# EAGLE board ESP32 Display 7.0 inch V1.2 (EAGLE 9.6.2), part 1 of 2
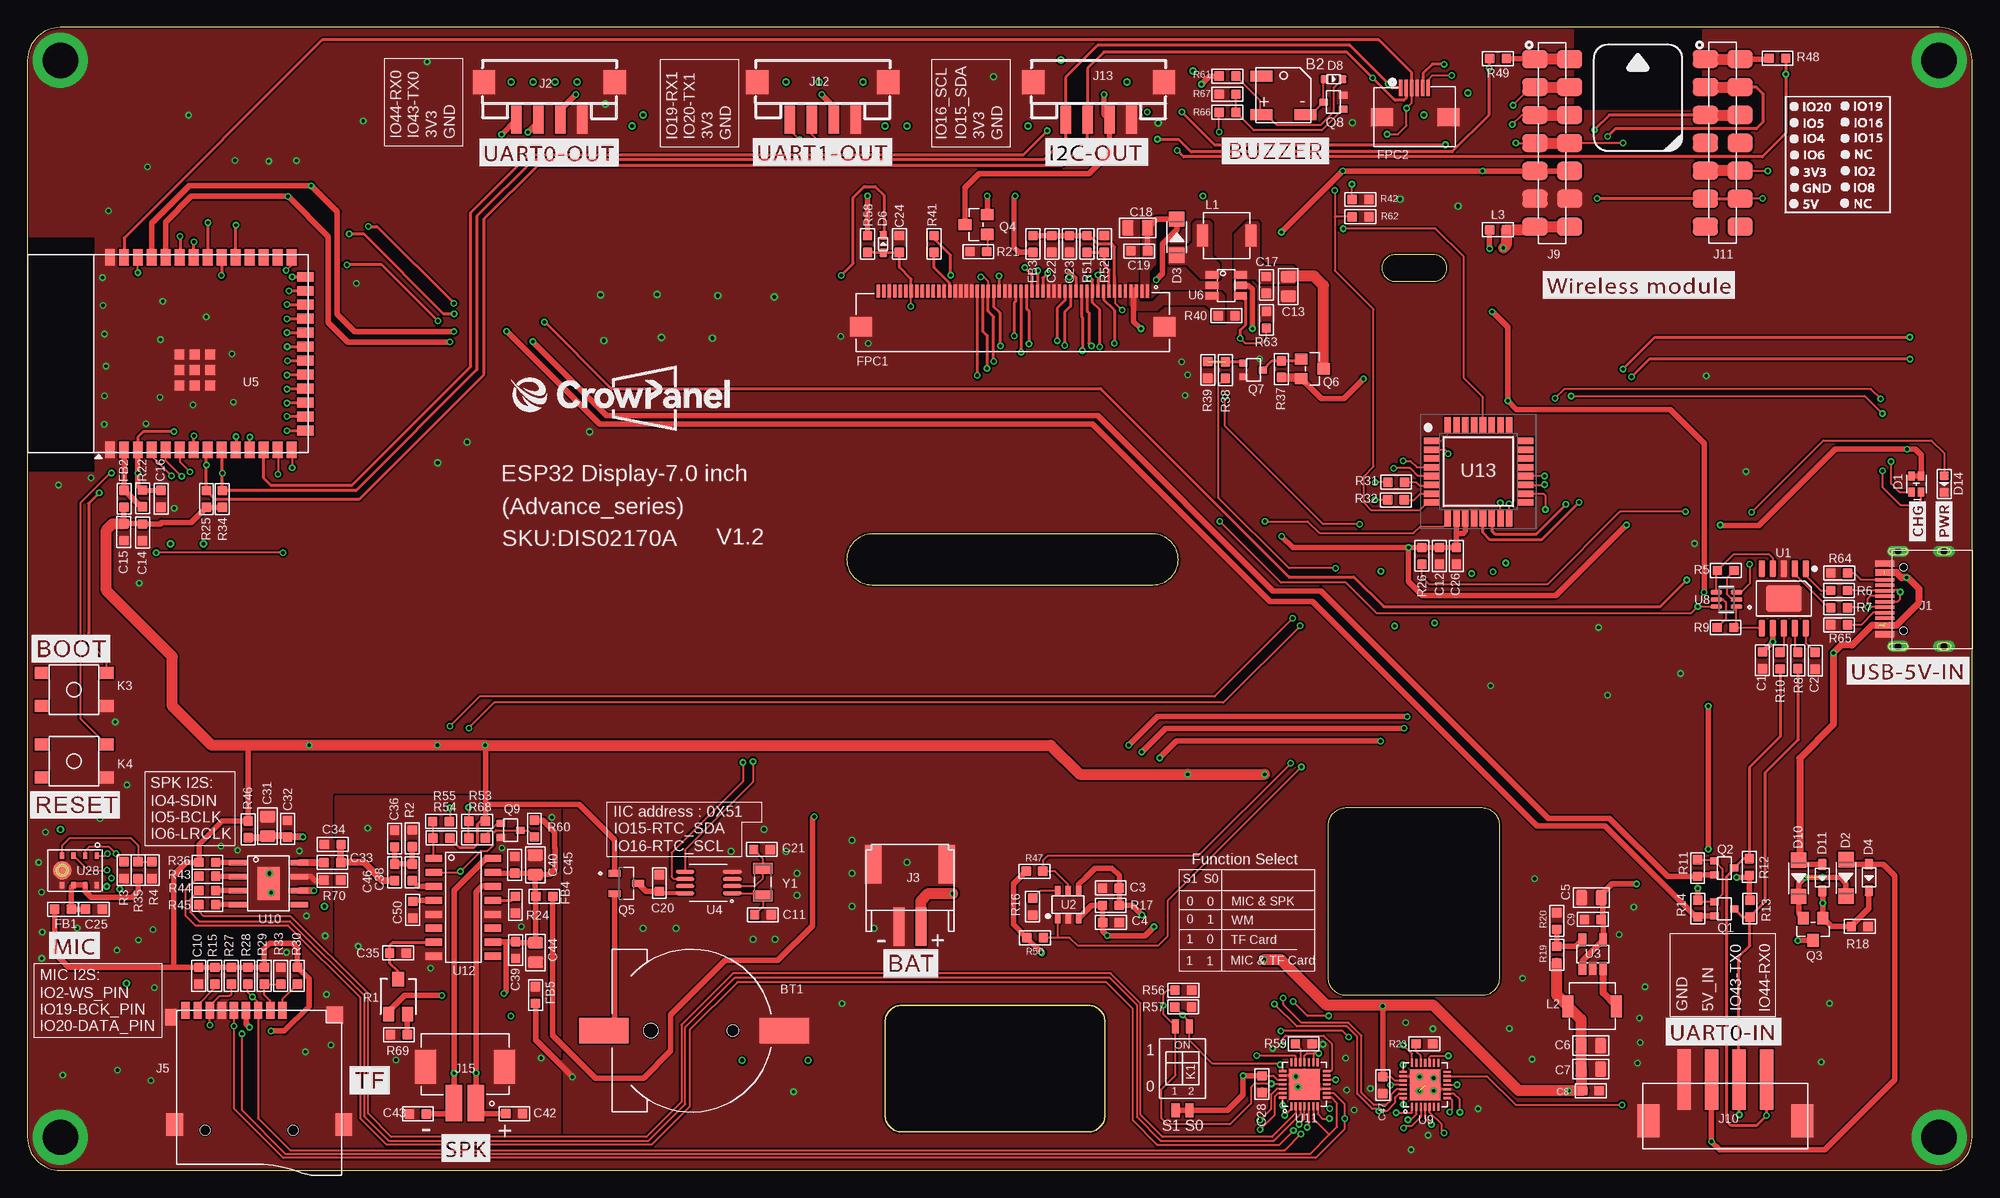
[diagram p5: board, top side]
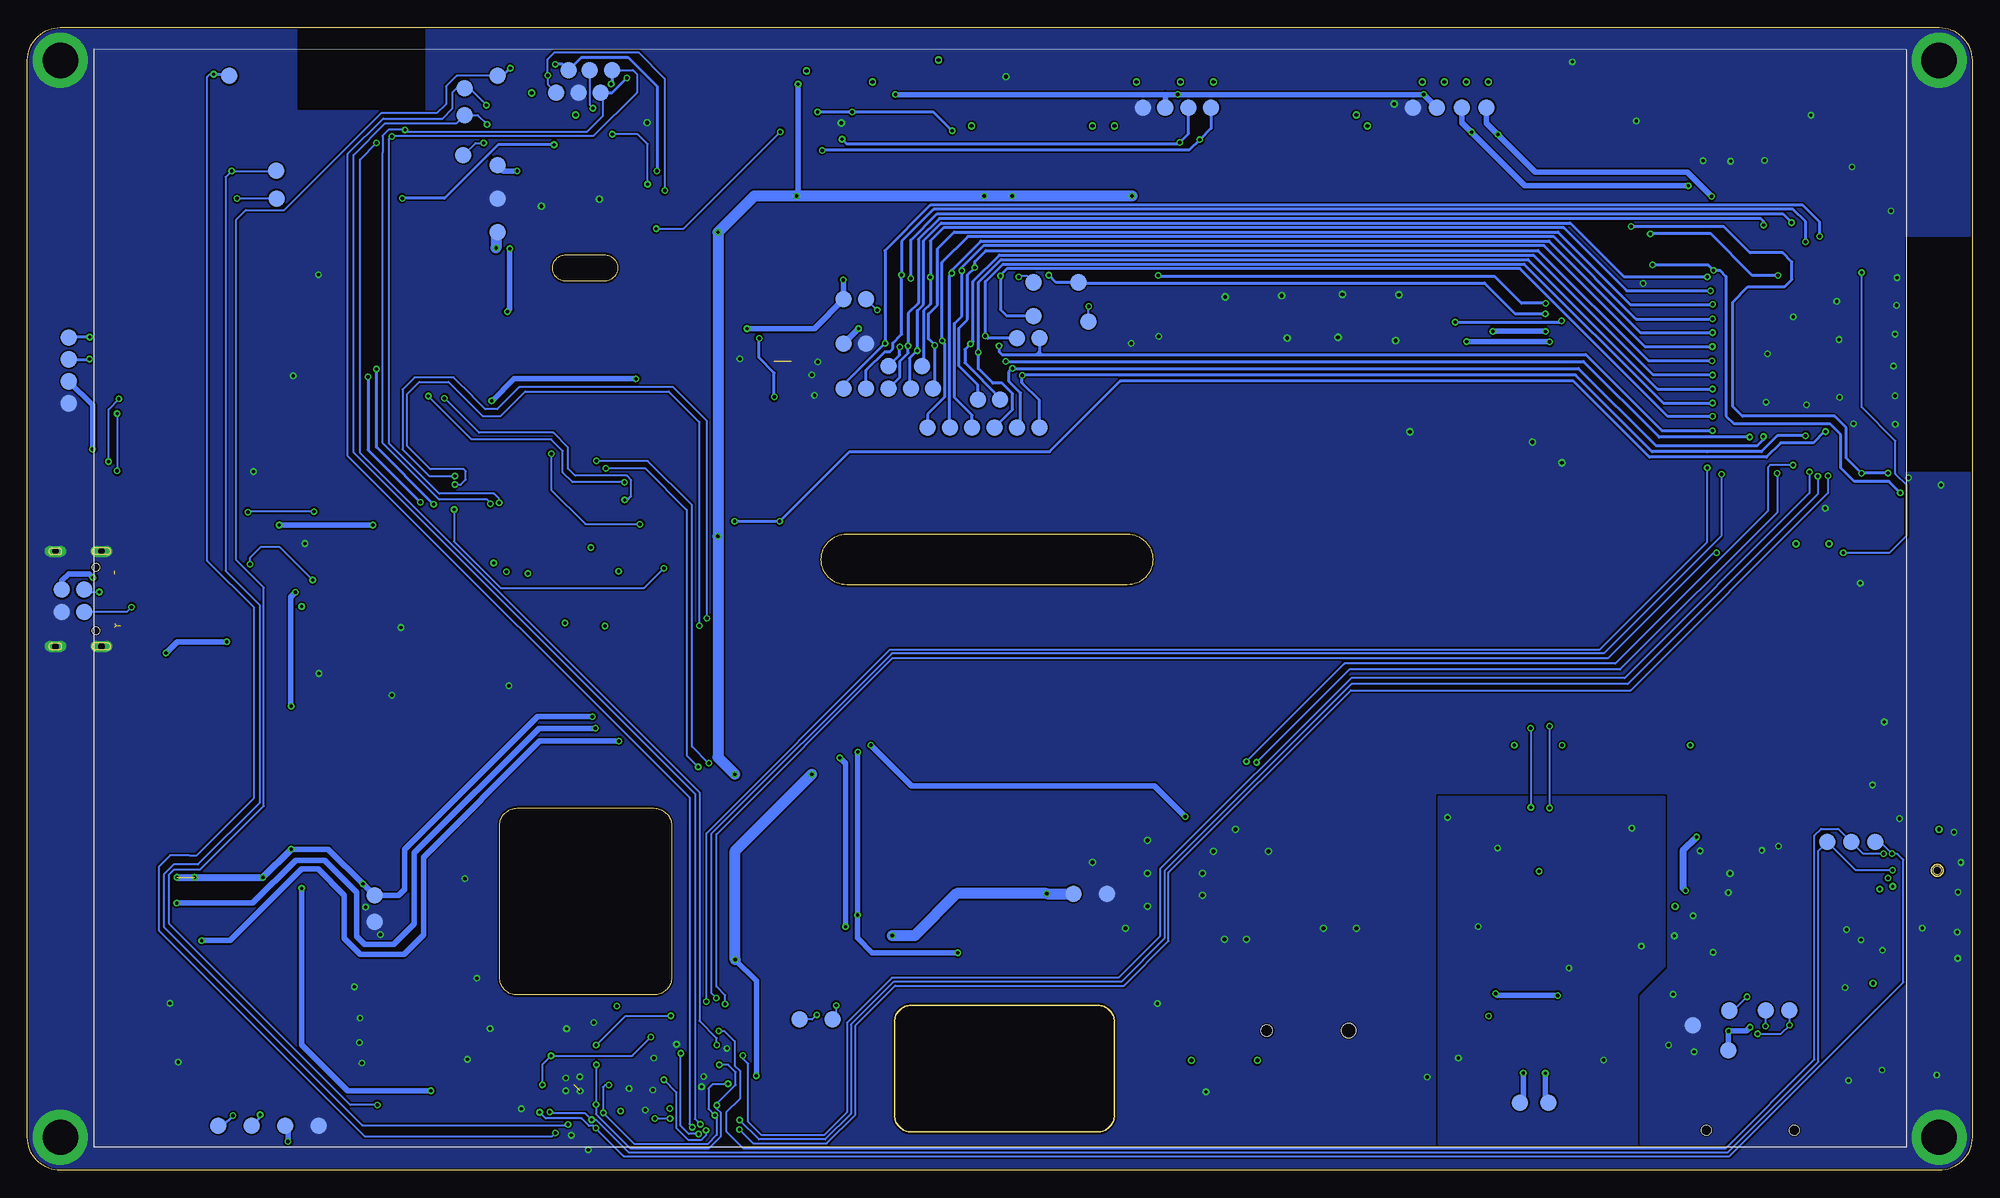
[diagram p6: board, bottom side, seen from below]

Size 176.86 x 103.96 mm. Coordinates in mm from the lower left corner, seen from the top.
Outline: 0,100.96 0,3 arc90 3,0 173.86,0 arc90 176.86,3 176.86,100.96 arc90 173.86,103.96 3,103.96 arc90 0,100.96
Outline: 132.32,32.95 119.88,32.95 arc90 118.28,31.34 118.28,17.55 arc90 119.88,15.95 132.32,15.95 arc90 133.92,17.55 133.92,31.34 arc90 132.32,32.95
Outline: 124.39,80.88 127.91,80.88 arc180 127.91,83.28 124.39,83.28 arc180 124.39,80.88
Outline: 76.82,53.26 102.36,53.26 arc180 102.36,57.88 76.82,57.88 arc180 76.82,53.26
Outline: 98,13.5 98,5 arc-90 96.5,3.5 79.5,3.5 arc-90 78,5 78,13.5 arc-90 79.5,15 96.5,15 arc-90 98,13.5
Outline: circle at 3.14,27.27 radius 0.51
Copper layers (1*16): Top 0.035mm / dielectric 1.5mm / Bottom 0.035mm
Design rules "HMI_GZ *": minimum track width 8mil, minimum drill 0.3mm, track to track 6mil, track to pad 6mil, pad to pad 4mil, via to via 6mil, smd to smd 6mil, copper to edge 6mil, drill to drill 4mil, minimum pad ring 6mil, minimum via ring 6mil, stop-mask expansion 4mil, vias tented up to drill 100mil, thermal gap 0mil
tKeepout: area 0,64 to 6,84.7; area 140,99.8 to 152.9,104
tRestrict: area 140.7,96.5 to 152.3,104; area 0,63.6 to 6.1,84.9
bRestrict: area 140.7,96.5 to 152.3,104; area 0,63.6 to 6.1,84.9

## Footprints (pad centres in the part's own frame; a part is rotated, then mirrored left to right if it is on the bottom)
BEEP_5025 = smd 2 x 1: 1 -2,-1.75; 2 2,-1.75; 3 -2,1.75
CR1220 = smd 2.3 x 4.5: N 0,8.425; P 0,-7.975 | hole 1.3: 0,-3.725 | hole 1.05: 0,3.725
C0603 = smd 0.889 x 0.889: 1 -0.762,0; 2 0.762,0
C0805 = smd 1.016 x 1.397: 1 -0.889,0; 2 0.889,0
LED_KT-0603RYG = smd 0.85 x 0.6: 1 0.725,-0.425; 2 0.725,0.425; 3 -0.725,-0.425; 4 -0.725,0.425
D_SOD123FL = smd 1.397 x 1.397: + -1.651,0; - 1.651,0
D_SOD323 = smd 1 x 0.8: + -1.2,0; - 1.2,0
D_SOD523 = smd 0.762 x 0.7: + -0.8,0; - 0.8,0
LED0603 = smd 0.762 x 0.889: + -0.762,0; - 0.762,0
L0603 = smd 0.889 x 0.889: 1 -0.762,0; 2 0.762,0
FPC-P0.5MM-50P-SMD = smd 2 x 1.8: 51 -13.8,-1.625; 52 13.8,-1.625 | smd 0.3 x 1.2: P$1 12.25,1.625; P$2 11.75,1.625; P$3 11.25,1.625; P$4 10.75,1.625; P$5 10.25,1.625; P$6 9.75,1.625; P$7 9.25,1.625; P$8 8.75,1.625; P$9 8.25,1.625; P$10 7.75,1.625; P$11 7.25,1.625; P$12 6.75,1.625; P$13 6.25,1.625; P$14 5.75,1.625; P$15 5.25,1.625; P$16 4.75,1.625; P$17 4.25,1.625; P$18 3.75,1.625; P$19 3.25,1.625; P$20 2.75,1.625; P$21 2.25,1.625; P$22 1.75,1.625; P$23 1.25,1.625; P$24 0.75,1.625; P$25 0.25,1.625; P$26 -0.25,1.625; P$27 -0.75,1.625; P$28 -1.25,1.625; P$29 -1.75,1.625; P$30 -2.25,1.625; P$31 -2.75,1.625; P$32 -3.25,1.625; P$33 -3.75,1.625; P$34 -4.25,1.625; P$35 -4.75,1.625; P$36 -5.25,1.625; P$37 -5.75,1.625; P$38 -6.25,1.625; P$39 -6.75,1.625; P$40 -7.25,1.625; P$41 -7.75,1.625; P$42 -8.25,1.625; P$43 -8.75,1.625; P$44 -9.25,1.625; P$45 -9.75,1.625; P$46 -10.25,1.625; P$47 -10.75,1.625; P$48 -11.25,1.625; P$49 -11.75,1.625; P$50 -12.25,1.625
FPC-6PIN-0.5MM = smd 0.3 x 1.5: 1 -1.31,2.184; 2 -0.81,2.184; 3 -0.31,2.184; 4 0.19,2.184; 5 0.69,2.184; 6 1.19,2.184 | smd 2 x 1.6: 7 -3.01,-0.496; 8 3.036,-0.496
USB-3.0TYPEC-SMD = smd 0.3 x 1.7: A1 -3.35,0.5; A4 -2.55,0.5; A5 -1.25,0.5; A6 -0.25,0.5; A7 0.25,0.5; A8 1.25,0.5; A9 2.55,0.5; A12 3.35,0.5; B1 3.05,0.5; B4 2.25,0.5; B5 1.75,0.5; B6 0.75,0.5; B7 -0.75,0.5; B8 -1.75,0.5; B9 -2.25,0.5; B12 -3.05,0.5 | drill 0.6 pad 1.016 long: P$1 -4.325,-0.72; P$2 4.325,-0.72; P$3 -4.325,-4.9; P$4 4.325,-4.9 | hole 0.68: -2.89,-1.22; 2.89,-1.22
CONNECTOR_4P-SMD-2.0 = smd 0.965 x 2.54: 1 -3,0; 2 -1,0; 3 1,0; 4 3,0 | smd 2.032 x 2.184: SS1 -5.946,3.4; SS2 5.946,3.4
PH2.0WT-2PIN = smd 1 x 3.5: P$1 -1,0; P$2 1,0 | smd 1.5 x 3.5: P$3 -3.35,-5.7; P$4 3.35,-5.7
THO-M3.2*5MM-HOLE = drill 3.2 pad 5: P$1 0,0
9P-SMD-W/-RING = smd 1.524 x 0.762: 1 0,4.4; 2 0,3.3; 3 0,2.2; 4 0,1.1; 5 0,0; 6 0,-1.1; 7 0,-2.2; 8 0,-3.3; 9 0,-4.4 | smd 1.524 x 1.016: G1 0.6,-5.746 | smd 2.032 x 1.524: G2 10.373,-5.4; G3 10.373,10 | smd 1.524 x 1.524: G4 0.392,9.181 | hole 0.889: 10.9,-2.6; 10.9,5.4
H7-2.54-18.28X2.5X5MM = smd 1.65 x 2.3: 1 -7.62,-1.58; 1-1 -7.62,1.58; 2 -5.08,-1.58; 2-2 -5.08,1.58; 3 -2.54,-1.58; 3-3 -2.54,1.58; 4 0,-1.58; 4-4 0,1.58; 5 2.54,-1.58; 5-5 2.54,1.58; 6 5.08,-1.58; 6-6 5.08,1.58; 7 7.62,-1.58; 7-7 7.62,1.58
XH2.54-4P-SMD = smd 1.2 x 5.5: 1 -3.75,-1.875; 2 -1.25,-1.875; 3 1.25,-1.875; 4 3.75,-1.875 | smd 2 x 3: 5 -7,1.875; 6 7,1.875
TEST-PIN-4-2.0MM = smd 1.5 x 1.5: 1 -3,0; 2 -1,0; 3 1,0; 4 3,0
CONN-TH_2P-P2.00_XUNPU_WAFER-PH2.0-2PLB = smd 1.5 x 3.3: 1 -1,1.65; 2 1,1.65 | smd 1.9 x 3.1: 3 3.6,-1.65; 4 -3.6,-1.65
SW-SMD_DSHP02TS-S_1 = smd 0.76 x 1.27: 1 -0.635,-3.81; 2 0.635,-3.81 | smd 0.635 x 1.27: 3 0.635,3.81; 4 -0.635,3.81
KEY-4.5X4.5-SMD = smd 1.35 x 1.1: 1 -2.925,1.5; 2 -2.925,-1.5; 3 2.925,-1.5; 4 2.925,1.5
L0420 = smd 2 x 1: 1 0,2.2; 2 0,-2.2
TEST_PAD-1.5MM = smd 1.5 x 1.5: P$1 0,0
MOS_SOT323 = smd 0.635 x 0.762: 1 -0.635,-0.889; 2 0.635,-0.889; 3 0,0.889
PMOS_SOT23 = smd 1.016 x 1.143: 1 -0.889,-1.016; 2 0.889,-1.016; 3 0,1.016
SOT-23 = smd 1.09 x 0.61: 1 -1.07,0.915; 2 -1.07,-0.915; 3 1.07,0
3P-SMD-SQUA-3.6X3.3 = smd 1 x 1.3: 1 -0.85,-1.6; 3 0.85,-1.6 | smd 1.1 x 1.3: 2 0,1.6
R0603-SP = smd 0.889 x 0.889: 1 -0.762,0; 2 0.762,0
ESOP-10-EP-150MIL = smd 1.5 x 0.6: 1 -2.7,2; 2 -2.7,1; 3 -2.7,0; 4 -2.7,-1; 5 -2.7,-2; 6 2.7,-2; 7 2.7,-1; 8 2.7,0; 9 2.7,1; 10 2.7,2 | smd 2.4 x 3.2: EP 0,0
SOT23-6L = smd 0.5 x 0.9: 1 -0.961,-1.212; 2 -0.011,-1.212; 3 0.94,-1.212; 4 0.94,1.288; 5 -0.011,1.288; 6 -0.961,1.288
IC_SOT23-5 = smd 0.69 x 1.2: 1 -0.95,-1.3; 2 0,-1.3; 3 0.95,-1.3; 4 0.95,1.3; 5 -0.95,1.3
MSOP-8 = smd 0.364 x 1.692: 1 -0.975,-2.146; 2 -0.325,-2.146; 3 0.325,-2.146; 4 0.975,-2.146; 5 0.975,2.146; 6 0.325,2.146; 7 -0.325,2.146; 8 -0.975,2.146
ESP32-S3-WROOM-1-SMD41 = smd 1.5 x 0.9: 1 -8.75,5.26; 2 -8.75,3.99; 3 -8.75,2.72; 4 -8.75,1.45; 5 -8.75,0.18; 6 -8.75,-1.09; 7 -8.75,-2.36; 8 -8.75,-3.63; 9 -8.75,-4.9; 10 -8.75,-6.17; 11 -8.75,-7.44; 12 -8.75,-8.71; 13 -8.75,-9.98; 14 -8.75,-11.25; 27 8.75,-11.25; 28 8.75,-9.98; 29 8.75,-8.71; 30 8.75,-7.44; 31 8.75,-6.17; 32 8.75,-4.9; 33 8.75,-3.63; 34 8.75,-2.36; 35 8.75,-1.09; 36 8.75,0.18; 37 8.75,1.45; 38 8.75,2.72; 39 8.75,3.99; 40 8.75,5.26 | smd 0.9 x 1.5: 15 -6.985,-12.5; 16 -5.715,-12.5; 17 -4.445,-12.5; 18 -3.175,-12.5; 19 -1.905,-12.5; 20 -0.635,-12.5; 21 0.635,-12.5; 22 1.905,-12.5; 23 3.175,-12.5; 24 4.445,-12.5; 25 5.715,-12.5; 26 6.985,-12.5 | smd 0.9 x 0.9: 41 -2.9,-1.06; 42 -1.5,-1.06; 43 -0.1,-1.06; 44 -2.9,-2.46; 45 -1.5,-2.46; 46 -0.1,-2.46; 47 -2.9,-3.86; 48 -1.5,-3.86; 49 -0.1,-3.86
COOPER_SOT23-6 = smd 0.69 x 1.2: 1 -0.95,-1.3; 2 0,-1.3; 3 0.95,-1.3; 4 0.95,1.3; 5 0,1.3; 6 -0.95,1.3
SOP65P210X100-6N = smd 1.09 x 0.4: 1 -0.92,0.65; 2 -0.92,0; 3 -0.92,-0.65; 4 0.92,-0.65; 5 0.92,0; 6 0.92,0.65
QFN-28_L4.0-W4.0-P0.40-BL-EP2.8 = smd 0.2 x 0.7: 1 -1.2,-2; 2 -0.8,-2; 3 -0.4,-2; 4 0,-2; 5 0.4,-2; 6 0.8,-2; 7 1.2,-2; 15 1.2,2; 16 0.8,2; 17 0.4,2; 18 0,2; 19 -0.4,2; 20 -0.8,2; 21 -1.2,2 | smd 0.7 x 0.2: 8 2,-1.2; 9 2,-0.8; 10 2,-0.4; 11 2,0; 12 2,0.4; 13 2,0.8; 14 2,1.2; 22 -2,1.2; 23 -2,0.8; 24 -2,0.4; 25 -2,0; 26 -2,-0.4; 27 -2,-0.8; 28 -2,-1.2 | smd 2.8 x 2.8: 29 0,0
NS4168-ESOP-8 = smd 1.6 x 0.5: 1 -2.8,1.905; 2 -2.8,0.635; 3 -2.8,-0.635; 4 -2.8,-1.905; 5 2.8,-1.905; 6 2.8,-0.635; 7 2.8,0.635; 8 2.8,1.905 | smd 2 x 3: 9 0,0
SOP-16 = smd 0.66 x 1.5: 1 -4.445,-2.7; 2 -3.175,-2.7; 3 -1.905,-2.7; 4 -0.635,-2.7; 5 0.635,-2.7; 6 1.905,-2.7; 7 3.175,-2.7; 8 4.445,-2.7; 9 4.445,2.7; 10 3.175,2.7; 11 1.905,2.7; 12 0.635,2.7; 13 -0.635,2.7; 14 -1.905,2.7; 15 -3.175,2.7; 16 -4.445,2.7
QFP80P900X900X165-32N = smd 1.475 x 0.6: 1 -4.238,2.8; 2 -4.238,2; 3 -4.238,1.2; 4 -4.238,0.4; 5 -4.238,-0.4; 6 -4.238,-1.2; 7 -4.238,-2; 8 -4.238,-2.8; 17 4.238,-2.8; 18 4.238,-2; 19 4.238,-1.2; 20 4.238,-0.4; 21 4.238,0.4; 22 4.238,1.2; 23 4.238,2; 24 4.238,2.8 | smd 0.6 x 1.475: 9 -2.8,-4.238; 10 -2,-4.238; 11 -1.2,-4.238; 12 -0.4,-4.238; 13 0.4,-4.238; 14 1.2,-4.238; 15 2,-4.238; 16 2.8,-4.238; 25 2.8,4.238; 26 2,4.238; 27 1.2,4.238; 28 0.4,4.238; 29 -0.4,4.238; 30 -1.2,4.238; 31 -2,4.238; 32 -2.8,4.238
IIS_INMP441 = smd 0.6 x 0.4: 1 1.203,-0.991; 2 1.203,0.059; 3 1.203,1.109; 4 1.203,2.159; 6 -1.457,2.159; 7 -1.457,1.109; 8 -1.457,0.059; 9 -1.457,-0.991 | smd 1.7 x 1.7: 5 -0.127,2.159
SMD3215-2P = smd 1 x 1.8: 1 -1.25,0; 2 1.25,0

## Placement (x,y rotation side)
B2  BEEP_5025  [BEEP_5025]  114.25,97.79 0 top
BT1  CR1220  [CR1220]  60.41,12.7 270 top
C1  1uF  [C0603]  157.81,46.39 90 top
C2  1uF  [C0603]  162.59,46.36 90 top
C3  1uF  [C0603]  98.53,25.67 0 top
C4  10uF/NC  [C0603]  98.55,22.54 180 top
C5  22uF  [C0805]  142.24,24.79 0 top
C6  22uF  [C0805]  142.19,11.33 180 top
C7  22uF  [C0805]  142.19,9.19 180 top
C8  1uF  [C0603]  142.19,7.24 180 top
C9  1uF  [C0603]  142.37,22.81 0 top
C10  1uF  [C0603]  15.57,17.7 90 top
C11  18pF  [C0603]  66.89,23.25 0 top
C12  10uF  [C0603]  128.42,55.89 90 top
C13  22uF  [C0805]  114.67,80.39 270 top
C14  10uF  [C0603]  10.47,58.02 90 top
C15  100nF  [C0603]  8.77,58.05 90 top
C16  1uF  [C0603]  12.14,61.09 90 top
C17  1uF  [C0603]  112.67,80.54 90 top
C18  22uF  [C0805]  100.97,85.73 180 top
C19  100nF  [C0603]  101.13,83.63 0 top
C20  1uF  [C0603]  57.47,26.13 90 top
C21  18pF  [C0603]  66.8,29.18 180 top
C22  1uF  [C0603]  93.17,84.26 90 top
C23  100nF  [C0603]  94.77,84.26 90 top
C24  1uF  [C0603]  79.3,84.26 270 top
C25  100nF  [C0603]  6.05,23.75 180 top
C26  100nF  [C0603]  129.96,55.89 90 top
C28  1uF  [C0603]  112.29,7.84 90 top
C31  47uF  [C0805]  21.84,31.29 90 top
C32  100nF  [C0603]  23.65,31.06 90 top
C33  10uF  [C0603]  27.74,27.99 180 top
C34  1nF  [C0603]  27.76,29.64 0 top
C35  100nF  [C0603]  33.71,19.76 180 top
C36  100nF/NC  [C0603]  33.4,30.18 270 top
C38  100nF  [C0603]  35,27.1 90 top
C39  100nF  [C0603]  44.4,20.04 90 top
C40  100nF  [C0603]  44.32,27.79 270 top
C42  1nF  [C0603]  44.27,5.16 180 top
C43  1nF  [C0603]  35.51,5.13 0 top
C44  22uF  [C0805]  46.2,19.81 90 top
C45  22uF  [C0805]  46.18,27.79 270 top
C46  1uF  [C0603]  33.4,27.1 270 top
C47  1uF  [C0603]  123.27,7.75 270 top
C50  4.7uF  [C0603]  35.05,23.7 90 top
D1  KT-0603RYG  [LED_KT-0603RYG]  171.8,62.43 90 top
D2  DSS34  [D_SOD123FL]  165.4,26.61 270 top
D3  DSS34  [D_SOD123FL]  104.53,84.88 90 top
D4  1N5817WS  [D_SOD323]  167.49,26.64 270 top
D6  B5819WT  [D_SOD523]  77.83,84.26 90 top
D8  B5819WT  [D_SOD523]  118.8,99.26 0 top
D10  DSS34  [D_SOD123FL]  161.09,26.57 270 top
D11  1N5817WS  [D_SOD323]  163.25,26.62 270 top
D14  Red  [LED0603]  174.33,62.43 270 top
FB1  0R/800mA  [L0603]  3.23,23.75 0 top
FB2  0R/800mA  [L0603]  8.78,61.1 90 top
FB3  0R/800mA  [L0603]  91.46,84.26 90 top
FB4  0R/600mA  [L0603]  47.02,24.92 180 top
FB5  0R/600mA  [L0603]  46.2,15.95 90 top
FPC1  TFT-7.0_LCD-50P  [FPC-P0.5MM-50P-SMD]  89.62,78.35 0 top
FPC2  FPC-6PIN-0.5MM  [FPC-6PIN-0.5MM]  126.22,96.29 0 top
J1  TYPEC-3.0-16P-SMD  [USB-3.0TYPEC-SMD]  169.42,51.98 90 top
J2  HY2.0-4P-SMT  [CONNECTOR_4P-SMD-2.0]  47.48,95.57 0 top
J3  PH2.0WT-2PIN  [PH2.0WT-2PIN]  80.26,22.15 180 top
J4  THO-M3.25MM-HOLE  [THO-M3.2*5MM-HOLE]  3,3 0 top
J5  [9P-SMD-W/-RING]  18.78,14.54 270 top
J6  THO-M3.25MM-HOLE  [THO-M3.2*5MM-HOLE]  3,100.96 0 top
J7  THO-M3.25MM-HOLE  [THO-M3.2*5MM-HOLE]  173.86,3 0 top
J8  THO-M3.25MM-HOLE  [THO-M3.2*5MM-HOLE]  173.86,100.96 0 top
J9  [H7-2.54-18.28X2.5X5MM]  138.68,93.45 270 top
J10  XH2.54-4P-SMT  [XH2.54-4P-SMD]  154.42,6.37 180 top
J11  [H7-2.54-18.28X2.5X5MM]  154.18,93.46 270 top
J12  HY2.0-4P-SMT  [CONNECTOR_4P-SMD-2.0]  72.33,95.57 0 top
J13  HY2.0-4P-SMT  [CONNECTOR_4P-SMD-2.0]  97.42,95.57 0 top
J14  HC-PZ200-8.7L-1X4PZ1  [TEST-PIN-4-2.0MM]  173.09,72.77 270 bottom
J15  WAFER-PH2.0-2PLB  [CONN-TH_2P-P2.00_XUNPU_WAFER-PH2.0-2PLB]  39.8,7.77 180 top
K1  DSHP02TS-S  [SW-SMD_DSHP02TS-S_1]  105.05,9.27 0 top
K3  KEY-4.5X4.5  [KEY-4.5X4.5-SMD]  4.24,43.73 180 top
K4  KEY-4.5X4.5  [KEY-4.5X4.5-SMD]  4.24,37.23 180 top
L1  4.7uH/3A  [L0420]  109.07,85.01 270 top
L2  4.7uH/3A  [L0420]  142.32,14.94 270 top
L3  NC  [L0603]  133.74,85.56 180 top
P1  TEST_PADPAD-1.5MM  [TEST_PAD-1.5MM]  173.74,52.83 0 bottom
P2  TEST_PADPAD-1.5MM  [TEST_PAD-1.5MM]  171.7,52.83 0 bottom
P3  TEST_PADPAD-1.5MM  [TEST_PAD-1.5MM]  171.7,50.8 0 bottom
P4  TEST_PADPAD-1.5MM  [TEST_PAD-1.5MM]  173.74,50.8 0 bottom
P5  TEST_PADPAD-1.5MM  [TEST_PAD-1.5MM]  106.65,13.72 90 bottom
P6  TEST_PADPAD-1.5MM  [TEST_PAD-1.5MM]  16.6,14.54 270 bottom
P7  TEST_PADPAD-1.5MM  [TEST_PAD-1.5MM]  18.77,14.55 270 bottom
P8  TEST_PADPAD-1.5MM  [TEST_PAD-1.5MM]  22.08,14.53 270 bottom
P9  TEST_PADPAD-1.5MM  [TEST_PAD-1.5MM]  81.74,25.15 0 bottom
P10  TEST_PADPAD-1.5MM  [TEST_PAD-1.5MM]  78.69,25.15 0 bottom
P11  TEST_PADPAD-1.5MM  [TEST_PAD-1.5MM]  145.3,25.02 0 bottom
P12  TEST_PADPAD-1.5MM  [TEST_PAD-1.5MM]  145.3,22.6 0 bottom
P13  TEST_PADPAD-1.5MM  [TEST_PAD-1.5MM]  22.15,10.92 0 bottom
P14  TEST_PADPAD-1.5MM  [TEST_PAD-1.5MM]  137.1,95.99 0 bottom
P15  TEST_PADPAD-1.5MM  [TEST_PAD-1.5MM]  137.12,98.43 0 bottom
P16  TEST_PADPAD-1.5MM  [TEST_PAD-1.5MM]  137.22,92.35 0 bottom
P17  TEST_PADPAD-1.5MM  [TEST_PAD-1.5MM]  153.42,4.06 0 bottom
P18  TEST_PADPAD-1.5MM  [TEST_PAD-1.5MM]  150.37,4.06 0 bottom
P19  TEST_PADPAD-1.5MM  [TEST_PAD-1.5MM]  156.46,4.06 0 bottom
P20  TEST_PADPAD-1.5MM  [TEST_PAD-1.5MM]  159.51,4.06 0 bottom
P21  TEST_PADPAD-1.5MM  [TEST_PAD-1.5MM]  103.63,13.72 90 bottom
P22  TEST_PADPAD-1.5MM  [TEST_PAD-1.5MM]  154.21,88.39 0 bottom
P23  TEST_PADPAD-1.5MM  [TEST_PAD-1.5MM]  154.23,90.93 0 bottom
P24  TEST_PADPAD-1.5MM  [TEST_PAD-1.5MM]  41.12,6.15 0 bottom
P25  TEST_PADPAD-1.5MM  [TEST_PAD-1.5MM]  80.37,77.21 0 bottom
P26  TEST_PADPAD-1.5MM  [TEST_PAD-1.5MM]  38.53,6.15 0 bottom
P27  TEST_PADPAD-1.5MM  [TEST_PAD-1.5MM]  8.81,29.87 0 bottom
P28  TEST_PADPAD-1.5MM  [TEST_PAD-1.5MM]  25.4,13.21 0 bottom
P29  TEST_PADPAD-1.5MM  [TEST_PAD-1.5MM]  10.97,29.87 0 bottom
P30  TEST_PADPAD-1.5MM  [TEST_PAD-1.5MM]  13.16,29.87 0 bottom
P32  TEST_PADPAD-1.5MM  [TEST_PAD-1.5MM]  48.67,96.67 0 bottom
P33  TEST_PADPAD-1.5MM  [TEST_PAD-1.5MM]  44.16,96.67 0 bottom
P34  TEST_PADPAD-1.5MM  [TEST_PAD-1.5MM]  46.41,96.67 0 bottom
P35  TEST_PADPAD-1.5MM  [TEST_PAD-1.5MM]  69.22,96.67 0 bottom
P36  TEST_PADPAD-1.5MM  [TEST_PAD-1.5MM]  71.25,96.67 0 bottom
P37  TEST_PADPAD-1.5MM  [TEST_PAD-1.5MM]  50.86,96.67 0 bottom
P38  TEST_PADPAD-1.5MM  [TEST_PAD-1.5MM]  127.64,100.08 0 bottom
P39  TEST_PADPAD-1.5MM  [TEST_PAD-1.5MM]  124.71,98.04 0 bottom
P40  TEST_PADPAD-1.5MM  [TEST_PAD-1.5MM]  123.7,100.08 0 bottom
P41  TEST_PADPAD-1.5MM  [TEST_PAD-1.5MM]  126.75,98.04 0 bottom
P43  TEST_PADPAD-1.5MM  [TEST_PAD-1.5MM]  73.38,96.67 0 bottom
P44  TEST_PADPAD-1.5MM  [TEST_PAD-1.5MM]  100.58,79.25 0 bottom
P45  TEST_PADPAD-1.5MM  [TEST_PAD-1.5MM]  100.58,75.18 0 bottom
P46  TEST_PADPAD-1.5MM  [TEST_PAD-1.5MM]  102.62,75.18 0 bottom
P47  TEST_PADPAD-1.5MM  [TEST_PAD-1.5MM]  102.62,79.25 0 bottom
P48  TEST_PADPAD-1.5MM  [TEST_PAD-1.5MM]  84.84,67.56 0 bottom
P49  TEST_PADPAD-1.5MM  [TEST_PAD-1.5MM]  86.87,67.56 0 bottom
P50  TEST_PADPAD-1.5MM  [TEST_PAD-1.5MM]  85.34,80.77 0 bottom
P51  TEST_PADPAD-1.5MM  [TEST_PAD-1.5MM]  84.84,75.69 0 bottom
P52  TEST_PADPAD-1.5MM  [TEST_PAD-1.5MM]  85.34,77.72 180 bottom
P53  TEST_PADPAD-1.5MM  [TEST_PAD-1.5MM]  86.87,75.69 0 bottom
P54  TEST_PADPAD-1.5MM  [TEST_PAD-1.5MM]  88.9,67.56 0 bottom
P55  TEST_PADPAD-1.5MM  [TEST_PAD-1.5MM]  88.39,70.1 0 bottom
P56  TEST_PADPAD-1.5MM  [TEST_PAD-1.5MM]  90.42,70.1 0 bottom
P57  TEST_PADPAD-1.5MM  [TEST_PAD-1.5MM]  90.93,67.56 0 bottom
P58  TEST_PADPAD-1.5MM  [TEST_PAD-1.5MM]  158.5,99.57 0 bottom
P59  TEST_PADPAD-1.5MM  [TEST_PAD-1.5MM]  134.11,99.57 0 bottom
P60  TEST_PADPAD-1.5MM  [TEST_PAD-1.5MM]  134.11,88.39 0 bottom
P61  TEST_PADPAD-1.5MM  [TEST_PAD-1.5MM]  134.11,91.44 0 bottom
P62  TEST_PADPAD-1.5MM  [TEST_PAD-1.5MM]  134.11,85.34 0 bottom
P63  TEST_PADPAD-1.5MM  [TEST_PAD-1.5MM]  92.96,67.56 0 bottom
P64  TEST_PADPAD-1.5MM  [TEST_PAD-1.5MM]  95,67.56 0 bottom
P65  TEST_PADPAD-1.5MM  [TEST_PAD-1.5MM]  94.49,71.12 0 bottom
P66  TEST_PADPAD-1.5MM  [TEST_PAD-1.5MM]  95.5,73.15 0 bottom
P67  TEST_PADPAD-1.5MM  [TEST_PAD-1.5MM]  96.52,71.12 0 bottom
P68  TEST_PADPAD-1.5MM  [TEST_PAD-1.5MM]  98.55,71.12 0 bottom
P69  TEST_PADPAD-1.5MM  [TEST_PAD-1.5MM]  81.28,80.77 0 bottom
P70  TEST_PADPAD-1.5MM  [TEST_PAD-1.5MM]  98.55,73.15 0 bottom
P71  TEST_PADPAD-1.5MM  [TEST_PAD-1.5MM]  100.58,71.12 0 bottom
P72  TEST_PADPAD-1.5MM  [TEST_PAD-1.5MM]  102.62,71.12 0 bottom
P73  TEST_PADPAD-1.5MM  [TEST_PAD-1.5MM]  75.41,96.67 0 bottom
P75  TEST_PADPAD-1.5MM  [TEST_PAD-1.5MM]  125.73,100.08 0 bottom
P76  TEST_PADPAD-1.5MM  [TEST_PAD-1.5MM]  128.78,98.04 0 bottom
Q1  BSS138W_SOT323  [MOS_SOT323]  154.35,23.78 270 top
Q2  BSS138W_SOT323  [MOS_SOT323]  154.34,27.49 270 top
Q3  AO3401  [PMOS_SOT23]  162.41,21.94 180 top
Q4  AO3401  [PMOS_SOT23]  86.28,86.03 90 top
Q5  BAT54C-7-F  [SOT-23]  54.46,26.1 0 top
Q6  AO3401  [PMOS_SOT23]  116.87,72.9 270 top
Q7  SS8050W-SOT323  [MOS_SOT323]  111.48,72.81 270 top
Q8  SS8050W-SOT323  [MOS_SOT323]  118.77,97.18 90 top
Q9  BSS138W_SOT323  [MOS_SOT323]  43.94,30.94 270 top
R1  10K  [3P-SMD-SQUA-3.6X3.3]  33.71,15.8 0 top
R2  4.7K  [R0603-SP]  35,30.2 270 top
R3  4.7K  [R0603-SP]  8.79,27.3 270 top
R4  0R  [R0603-SP]  11.33,27.3 90 top
R5  10K  [R0603-SP]  154.46,54.56 180 top
R6  0R  [R0603-SP]  164.77,52.74 0 top
R7  0R  [R0603-SP]  164.78,51.18 0 top
R8  0R  [R0603-SP]  161.02,46.38 90 top
R9  10K  [R0603-SP]  154.44,49.38 0 top
R10  0R  [R0603-SP]  159.42,46.37 90 top
R11  4.7K  [R0603-SP]  151.9,27.49 270 top
R12  4.7K  [R0603-SP]  156.61,27.6 90 top
R13  4.7K  [R0603-SP]  156.66,23.8 270 top
R14  4.7K  [R0603-SP]  151.92,23.81 270 top
R15  10K  [R0603-SP]  17.05,17.7 90 top
R16  2K  [R0603-SP]  91.42,23.99 90 top
R17  5.1K  [R0603-SP]  98.53,24.1 0 top
R18  10K  [R0603-SP]  166.64,22.18 180 top
R19  45.3K  [R0603-SP]  139.09,19.61 270 top
R20  10K  [R0603-SP]  139.09,22.68 270 top
R21  10K  [R0603-SP]  86.49,83.57 0 top
R22  10K  [R0603-SP]  10.47,61.12 90 top
R23  10K  [R0603-SP]  127.05,11.51 0 top
R24  47K  [R0603-SP]  44.37,24.16 90 top
R25  4.7K  [R0603-SP]  16.28,61.07 270 top
R26  5.1K  [R0603-SP]  126.83,55.89 90 top
R27  10K  [R0603-SP]  18.55,17.7 90 top
R28  10K  [R0603-SP]  20.05,17.7 90 top
R29  10K/NC  [R0603-SP]  21.55,17.7 90 top
R30  10K  [R0603-SP]  24.55,17.7 90 top
R31  2K  [R0603-SP]  124.49,62.59 0 top
R32  5.1K  [R0603-SP]  124.46,60.99 0 top
R33  10K  [R0603-SP]  23.05,17.7 90 top
R34  4.7K  [R0603-SP]  17.72,61.07 270 top
R35  NC/0R  [R0603-SP]  10.06,27.3 270 top
R36  100K  [R0603-SP]  16.36,28.02 180 top
R37  100K  [R0603-SP]  114.05,72.88 270 top
R38  100R  [R0603-SP]  108.95,72.79 270 top
R39  10K  [R0603-SP]  107.35,72.8 270 top
R40  1.5R  [R0603-SP]  109.05,77.74 180 top
R41  0R  [R0603-SP]  82.46,84.26 90 top
R42  5.1K  [R0603-SP]  121.24,88.32 180 top
R43  0R  [R0603-SP]  16.36,26.75 180 top
R44  0R  [R0603-SP]  16.36,25.45 180 top
R45  0R  [R0603-SP]  16.36,24.18 180 top
R46  0R  [R0603-SP]  20.07,31.01 90 top
R47  5.1K  [R0603-SP]  91.59,27.2 180 top
R48  0R  [R0603-SP]  159.17,101.16 0 top
R49  0R  [R0603-SP]  133.74,101.14 180 top
R50  5.1K  [R0603-SP]  91.64,21.16 180 top
R51  10K  [R0603-SP]  96.36,84.26 270 top
R52  10K/NC  [R0603-SP]  97.95,84.26 90 top
R53  10K  [R0603-SP]  40.89,31.75 180 top
R54  10K  [R0603-SP]  37.64,30.23 180 top
R55  1K  [R0603-SP]  37.62,31.72 0 top
R56  10K  [R0603-SP]  105.13,16.38 0 top
R57  10K  [R0603-SP]  105.11,14.86 0 top
R58  NC  [R0603-SP]  76.4,84.26 90 top
R59  10K  [R0603-SP]  116.08,11.51 0 top
R60  10K  [R0603-SP]  46.1,31.09 270 top
R61  3.9R  [R0603-SP]  109.14,99.54 180 top
R62  5.1K  [R0603-SP]  121.24,86.74 180 top
R63  10K  [R0603-SP]  112.68,77.37 270 top
R64  5.1K  [R0603-SP]  164.78,54.33 0 top
R65  5.1K  [R0603-SP]  164.77,49.62 180 top
R66  1K  [R0603-SP]  109.14,96.24 180 top
R67  47K  [R0603-SP]  109.14,97.89 180 top
R68  1K  [R0603-SP]  40.89,30.23 180 top
R69  2K  [R0603-SP]  33.78,12.34 180 top
R70  0R  [R0603-SP]  27.74,26.39 0 top
U1  CH340K  [ESOP-10-EP-150MIL]  159.74,52.03 270 top
U2  TP4059-SOT23-6  [SOT23-6L]  94.66,24.12 0 top
U3  RY3420  [IC_SOT23-5]  142.37,19.66 0 top
U4  PCF8563  [MSOP-8]  61.96,26.18 90 top
U5  ESP32-S3-WROOM-1  [ESP32-S3-WROOM-1-SMD41]  12.77,74.29 90 top
U6  MT9201  [COOPER_SOT23-6]  109.02,80.49 270 top
U8  UMH3NTN  [SOP65P210X100-6N]  154.52,51.93 180 top
U9  CH486F  [QFN-28_L4.0-W4.0-P0.40-BL-EP2.8]  127.13,7.77 0 top
U10  NS4168-ESOP-8  [NS4168-ESOP-8]  21.92,26.09 0 top
U11  CH486F  [QFN-28_L4.0-W4.0-P0.40-BL-EP2.8]  116.15,7.82 0 top
U12  NS4268-SOP16  [SOP-16]  39.65,23.93 270 top
U13  STC8H1K28-36I-LQFP32  [QFP80P900X900X165-32N]  131.97,63.56 0 top
U28  IIS_INMP441  [IIS_INMP441]  5.31,27.41 90 top
Y1  32.768KHZ  [SMD3215-2P]  66.88,26.2 90 top